# EAGLE design dronestand (EAGLE 9.3.2)
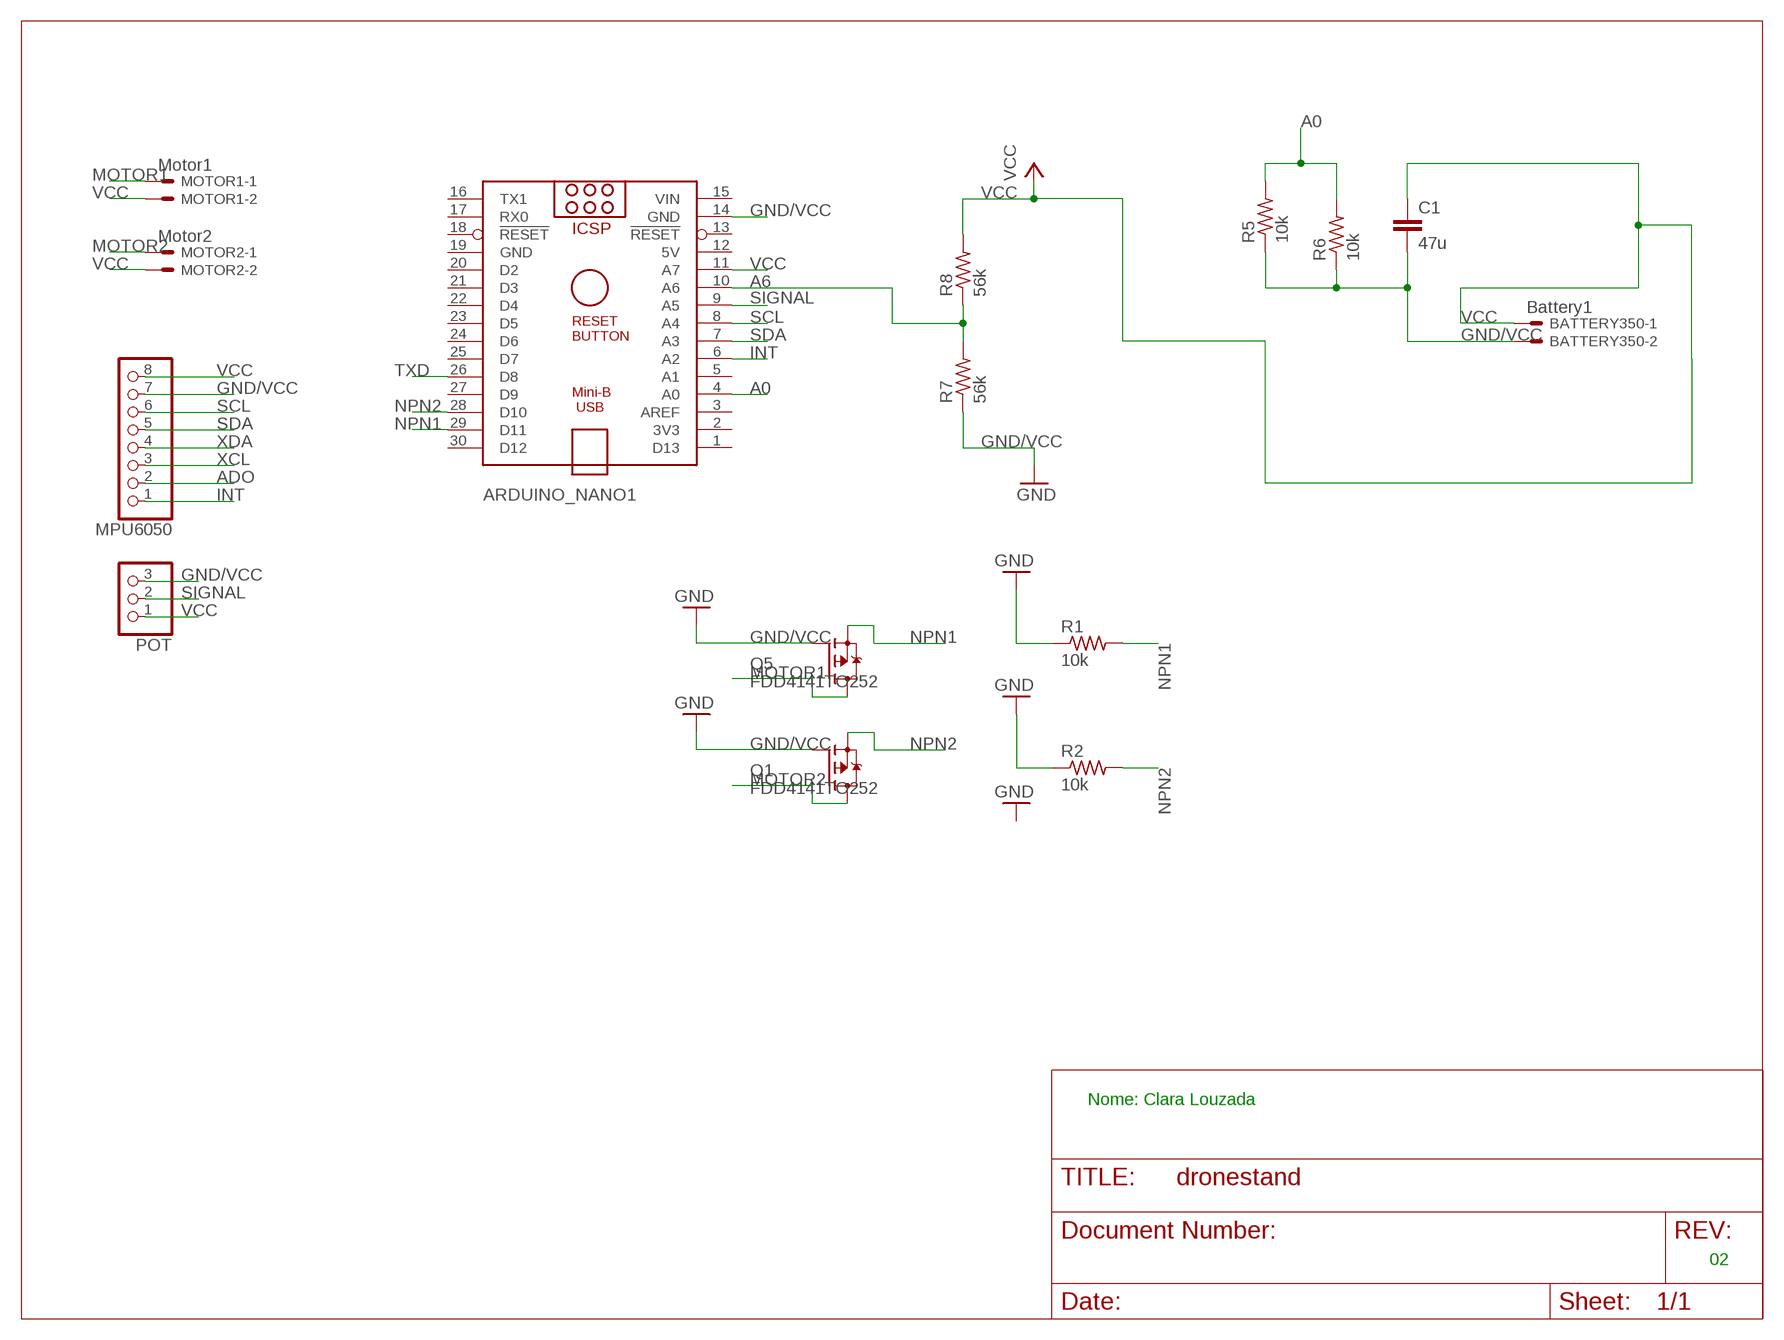
[diagram p0: schematic, sheet 1]

## Parts
ARDUINO_NANO1  ARDUINO_NANO  [ARDUINO_NANO]
BATTERY350  Battery1  JST-XH-02-PIN-LONG-PAD  [JST-XH-02-PACKAGE-LONG-PAD]
C1  47u  C2,5-3  [C2.5-3]
MOTOR1  Motor1  JST-XH-02-PIN-LONG-PAD  [JST-XH-02-PACKAGE-LONG-PAD]
MOTOR2  Motor2  JST-XH-02-PIN-LONG-PAD  [JST-XH-02-PACKAGE-LONG-PAD]
MPU6050  PINHD-1X8  [1X08]
POT  PINHD-1X3  [1X03]
Q1  FDD4141TO252  [TO252]
Q5  FDD4141TO252  [TO252]
R1  10k  R-US_0204/7  [0204/7]
R2  10k  R-US_0204/7  [0204/7]
R5  10k  R-US_0204/7  [0204/7]
R6  10k  R-US_0204/7  [0204/7]
R7  56k  R-US_0204/7  [0204/7]
R8  56k  R-US_0204/7  [0204/7]

## Nets
A0: ARDUINO_NANO1.4(A0) R5.2 R6.2
A6: ARDUINO_NANO1.10(A6) R7.2 R8.1
ADO: MPU6050.2
GND/VCC: ARDUINO_NANO1.14(GND) BATTERY350.2 C1.2 MPU6050.7 POT.3 Q1.1(G) Q5.1(G) R1.1 R2.1 R5.1 R6.1 R7.1 ; supply symbol labelled GND
INT: ARDUINO_NANO1.6(A2) MPU6050.1
MOTOR1: MOTOR1.1 Q5.3(D)
MOTOR2: MOTOR2.1 Q1.3(D)
NPN1: ARDUINO_NANO1.29(D11) Q5.2(S) R1.2
NPN2: ARDUINO_NANO1.28(D10) Q1.2(S) R2.2
SCL: ARDUINO_NANO1.8(A4) MPU6050.6
SDA: ARDUINO_NANO1.7(A3) MPU6050.5
SIGNAL: ARDUINO_NANO1.9(A5) POT.2
TXD: ARDUINO_NANO1.26(D8)
VCC: ARDUINO_NANO1.11(A7) BATTERY350.1 C1.1 MOTOR1.2 MOTOR2.2 MPU6050.8 POT.1 R8.2
XCL: MPU6050.3
XDA: MPU6050.4
Unconnected: ARDUINO_NANO1.1(D13) ARDUINO_NANO1.2(3V3) ARDUINO_NANO1.3(AREF) ARDUINO_NANO1.5(A1) ARDUINO_NANO1.13(!RESET) ARDUINO_NANO1.16(TX1) ARDUINO_NANO1.17(RX0) ARDUINO_NANO1.18(!RESET) ARDUINO_NANO1.20(D2) ARDUINO_NANO1.21(D3) ARDUINO_NANO1.22(D4) ARDUINO_NANO1.23(D5) ARDUINO_NANO1.24(D6) ARDUINO_NANO1.25(D7) ARDUINO_NANO1.27(D9) ARDUINO_NANO1.30(D12)

## Notes on the sheet
- Nome: Clara Louzada
- 02

## Power pins joined to a net without a drawn wire
5V: ARDUINO_NANO1.12(5V)
GND/VCC: ARDUINO_NANO1.19(GND)
VIN: ARDUINO_NANO1.15(VIN)

## Library data of the parts
ARDUINO_NANO1 = ArduinoNanoV30:ARDUINO_NANO: Arduino Nano V3.0 Overview: The Arduino Nano is a small, complete, and breadboard-friendly board based on the ATmega328 (Arduino Nano 3.x) or ATmega168 (Arduino Nano 2.x). It has more or less the same functionality of the Arduino Duemilanove, but in a different package. It lacks only a DC power jack, and works with a Mini-B USB cable instead of a standard one. The Nano was designed and is being produced by Gravitech. Specifications: Microcontroller Atmel ATmega168 or ATmega328 Operating Voltage (logic level) 5 V Input Voltage (recommended) 7-12 V Input Voltage (limits) 6-20 V Digital I/O Pins 14 (of which 6 provide PWM output) Analog Input Pins 8 DC Current per I/O Pin 40 mA Flash Memory 16 KB (ATmega168) or 32 KB (ATmega328) of which 2 KB used by bootloader SRAM 1 KB (ATmega168) or 2 KB (ATmega328) EEPROM 512 bytes (ATmega168) or 1 KB (ATmega328) Clock Speed 16 MHz Dimensions 0.73" x 1.70" Length 45 mm Width 18 mm Weigth 5 g Power: The Arduino Nano can be powered via the Mini-B USB connection, 6-20V unregulated external power supply (pin 30), or 5V regulated external power supply (pin 27). The power source is automatically selected to the highest voltage source. Memory: The ATmega168 has 16 KB of flash memory for storing code (of which 2 KB is used for the bootloader); the ATmega328 has 32 KB, (also with 2 KB used for the bootloader). The ATmega168 has 1 KB of SRAM and 512 bytes of EEPROM (which can be read and written with the EEPROM library); the ATmega328 has 2 KB of SRAM and 1 KB of EEPROM. Input and Output: Each of the 14 digital pins on the Nano can be used as an input or output, using pinMode(), digitalWrite(), and digitalRead() functions. They operate at 5 volts. Each pin can provide or receive a maximum of 40 mA and has an internal pull-up resistor (disconnected by default) of 20-50 kOhms. In addition, some pins have specialized functions. Visit Arduino - ArduinoBoardNano <https://www.arduino.cc/en/Main/ArduinoBoardNano>
BATTERY350 MOTOR1 MOTOR2 = Rembrandt Electronics - JST XH Connectors v1-0:JST-XH-02-PIN: JST XH Connector 2 Pin Wire to board connector. Pitch: 2,54 mm, (0.100") Number of pins: 2 Created by Rembrandt Electronics www.rembrandtelectronics.com
C1 = capacitor-wima:C: CAPACITOR naming: grid - package width
MPU6050 = pinhead:PINHD-1X8: PIN HEADER
POT = pinhead:PINHD-1X3: PIN HEADER
Q1 Q5 = transistor-fet:FDD4141: P-Channel PowerTrench® MOSFET Source: FDD4141.pdf
R1 R2 R5-R8 = resistor:R-US_: RESISTOR, American symbol

## Board
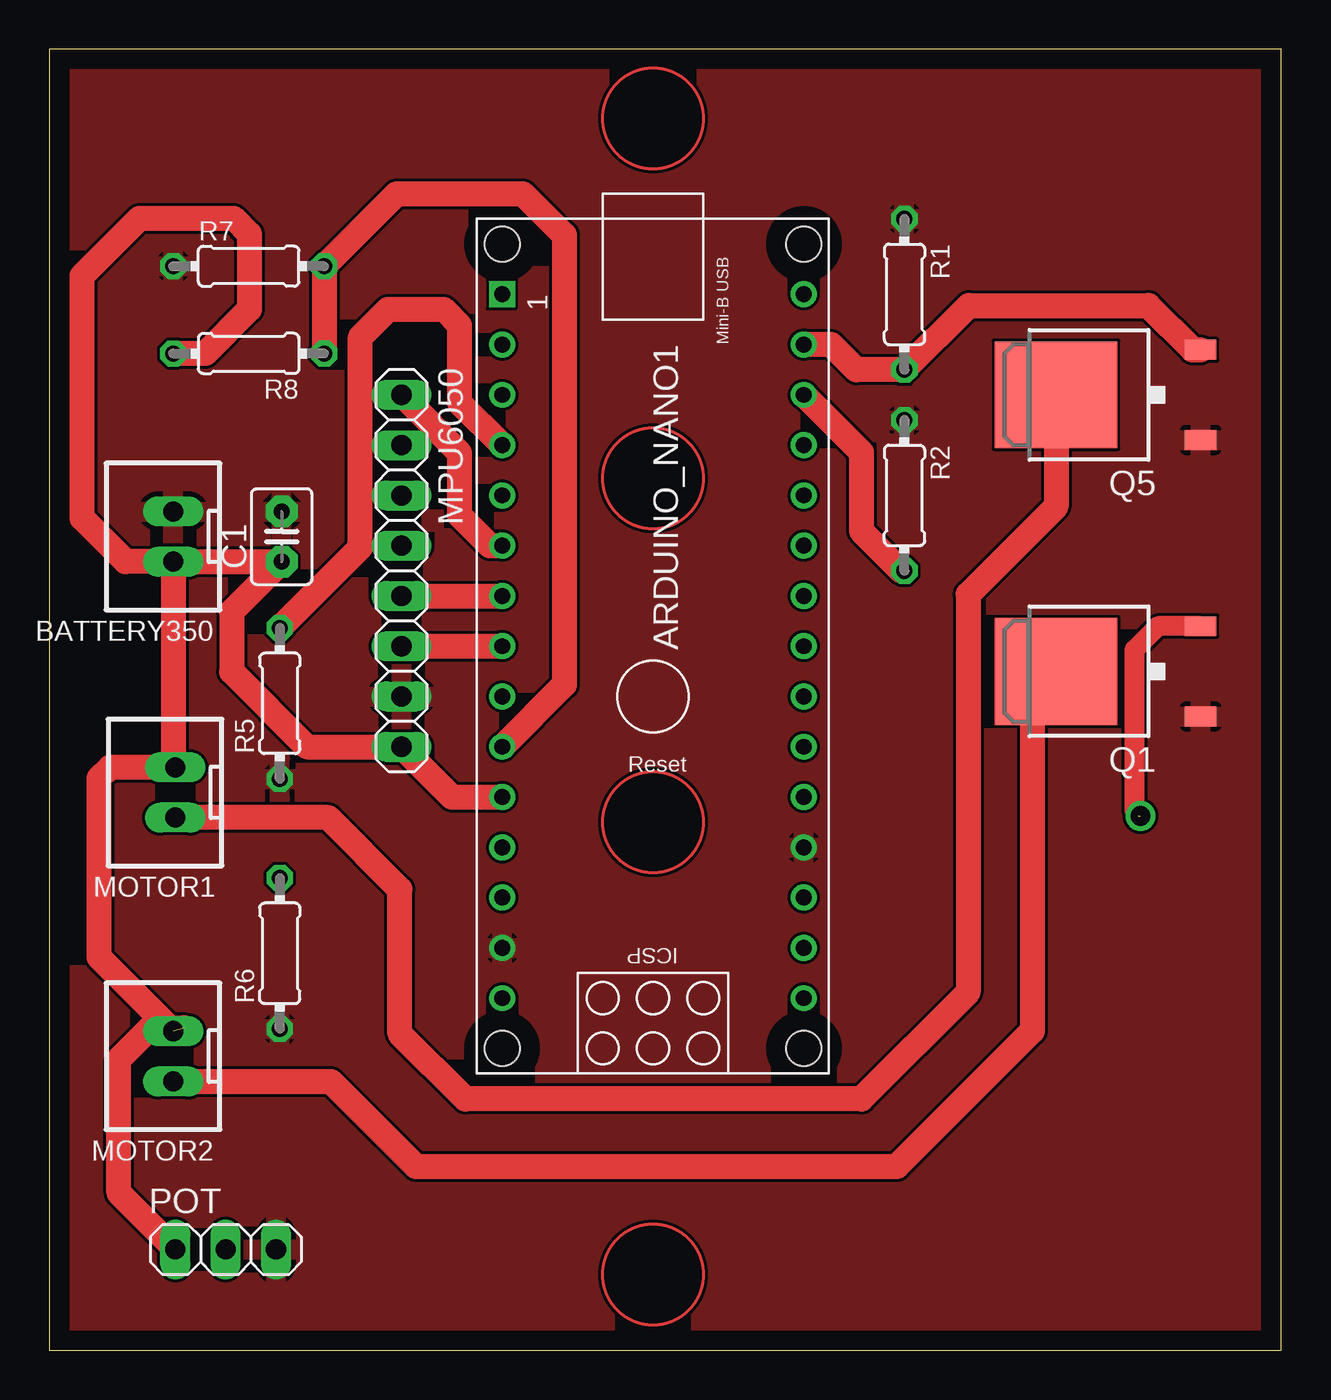
[diagram p1: board, top side]
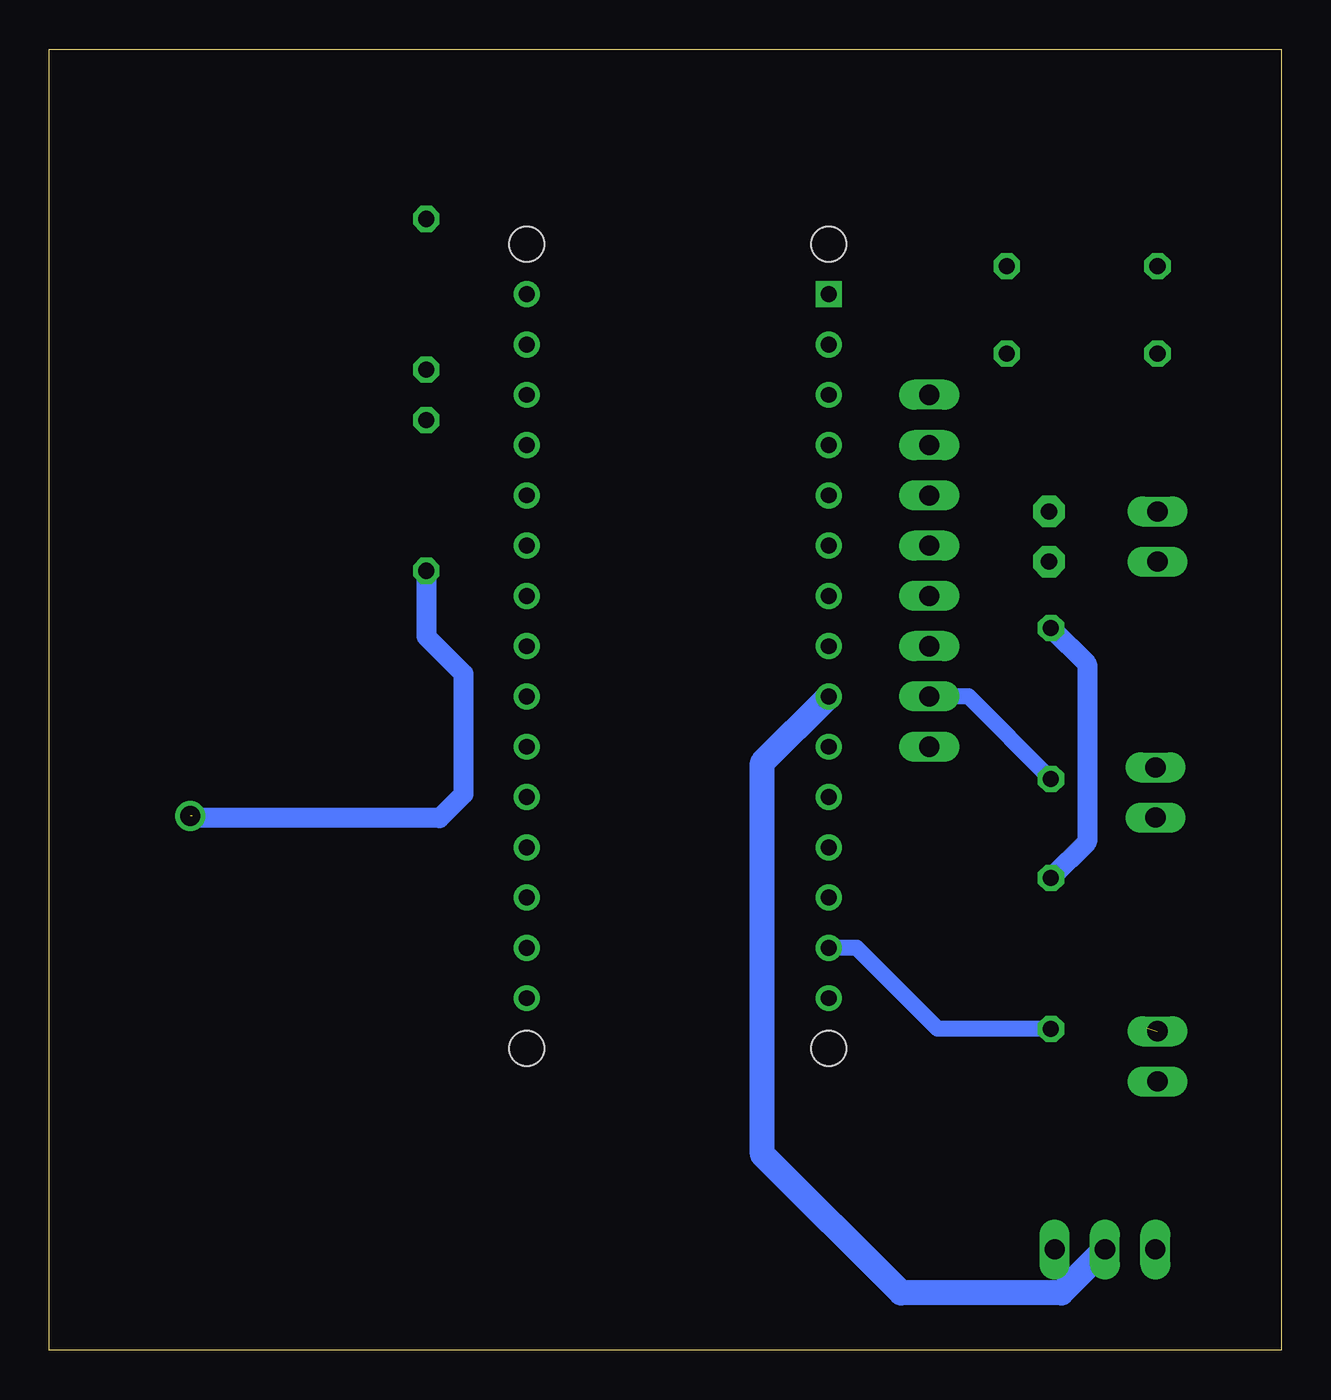
[diagram p2: board, bottom side, seen from below]

Size 62.21 x 65.71 mm. Coordinates in mm from the lower left corner, seen from the top.
Outline: 0,0 62.21,0 62.21,65.71 0,65.71 0,0
Copper layers (1*16): Top 0.035mm / dielectric 1.5mm / Bottom 0.035mm
Design rules "default": minimum track width 6mil, minimum drill 0.35mm, track to track 6mil, track to pad 6mil, pad to pad 6mil, via to via 6mil, smd to smd 6mil, copper to edge 40mil, drill to drill 6mil, minimum pad ring 10mil, minimum via ring 8mil, stop-mask expansion 4mil, vias tented up to drill 0mil, thermal gap 10mil

### Footprints (pad centres in the part's own frame; a part is rotated, then mirrored left to right if it is on the bottom)
ARDUINO_NANO = drill 0.8 square: 1 -20.32,-7.62 | drill 0.8: 2 -17.78,-7.62; 3 -15.24,-7.62; 4 -12.7,-7.62; 5 -10.16,-7.62; 6 -7.62,-7.62; 7 -5.08,-7.62; 8 -2.54,-7.62; 9 0,-7.62; 10 2.54,-7.62; 11 5.08,-7.62; 12 7.62,-7.62; 13 10.16,-7.62; 14 12.7,-7.62; 15 15.24,-7.62; 16 15.24,7.62; 17 12.7,7.62; 18 10.16,7.62; 19 7.62,7.62; 20 5.08,7.62; 21 2.54,7.62; 22 0,7.62; 23 -2.54,7.62; 24 -5.08,7.62; 25 -7.62,7.62; 26 -10.16,7.62; 27 -12.7,7.62; 28 -15.24,7.62; 29 -17.78,7.62; 30 -20.32,7.62 | hole 1.778: -22.86,-7.62; -22.86,7.62; 17.78,7.62; 17.78,-7.62
JST-XH-02-PACKAGE-LONG-PAD = drill 1.016 long: 1 -1.27,0; 2 1.27,0
C2.5-3 = drill 0.813 pad 1.6 octagon: 1 -1.27,0; 2 1.27,0
1X08 = drill 1.016 long: 1 -8.89,0; 2 -6.35,0; 3 -3.81,0; 4 -1.27,0; 5 1.27,0; 6 3.81,0; 7 6.35,0; 8 8.89,0
1X03 = drill 1.016 long: 1 -2.54,0; 2 0,0; 3 2.54,0
TO252 = smd 1 x 1.6: 1 -2.28,-4.8; 2 2.28,-4.8 | smd 5.4 x 6.2: 3 0,2.5
0204/7 = drill 0.813 octagon: 1 -3.81,0; 2 3.81,0

### Placement (x,y rotation side)
ARDUINO_NANO1  30.48,33.02 270 top
BATTERY350  6.25,41.1 90 top
C1  11.73,41.1 90 top
MOTOR1  6.35,28.17 90 top
MOTOR2  6.25,14.84 90 top
MPU6050  17.78,39.37 270 top
POT  8.9,5.08 0 top
Q1  53.34,34.29 90 top
Q5  53.34,48.26 90 top
R1  43.18,53.34 270 top
R2  43.18,43.18 270 top
R5  11.63,32.67 90 top
R6  11.63,20.04 90 top
R7  10.06,54.76 0 top
R8  10.06,50.35 180 top

### Tracks (layer width: path | path; a pad name or v marks a point on that pad's centre or on a via)
A0
  Top 1.27: R5.2 15.7,40.55 15.7,51.18 17.1,52.58 19.9,52.58 20.7,51.78 20.7,47.88 ARDUINO_NANO1.4
  Bottom 1.016: R5.2 9.8,34.65 9.8,25.68 R6.2
A6
  Top 1.27: R8.1 R7.2 17.53,58.42 23.91,58.42 26,56.33 26,33.62 ARDUINO_NANO1.10
GND/VCC
  Bottom 0.813: R6.1 17.35,16.23 21.44,20.32 ARDUINO_NANO1.14 | R5.1 15.79,33.02 MPU6050.7
  pour Top: 0.3,65.68 62,65.68 62.1,65.78 62.1,0.08 62.2,-0.02 0.2,-0.02 0.1,0.08 0.1,65.78
INT
  Top 1.27: MPU6050.1 20.7,45.34 20.7,42.18 22.24,40.64 ARDUINO_NANO1.6
MOTOR1
  Top 1.27: Q5.3 50.84,42.62 46.4,38.18 46.4,18.08 41,12.68 21,12.68 17.7,15.98 17.7,23.28 14.08,26.9 MOTOR1.1
MOTOR2
  Top 1.27: MOTOR2.1 14.21,13.57 18.5,9.28 42.8,9.28 49.64,16.12 49.64,33.09 Q1.3
N$1  (via drill 1)
  other vias: 55.1,26.98
NPN1
  Top 1.27: ARDUINO_NANO1.29 39.48,50.8 40.75,49.53 R1.2 46.43,52.78 55.5,52.78 57.74,50.54 Q5.2
NPN2  (1 unrouted)
  Top 1.016: Q1.2 55.99,36.57 54.8,35.38 54.8,27.28 55.1,26.98
  Top 1.27: ARDUINO_NANO1.28 41,45.36 41,41.38 43.01,39.37 R2.2
  Bottom 1.016: R2.2 43.18,36.06 41.3,34.18 41.3,28.08 42.5,26.88 54.9,26.88 55,26.98
SCL
  Top 1.27: MPU6050.6 ARDUINO_NANO1.8
SDA
  Top 1.27: MPU6050.5 ARDUINO_NANO1.7
SIGNAL
  Bottom 1.27: POT.2 11.1,2.88 19.2,2.88 26.2,9.88 26.2,29.68 ARDUINO_NANO1.9
VCC  (1 unrouted)
  Top 1.27: BATTERY350.1 C1.1 9.2,37.3 9.2,34.28 13,30.48 MPU6050.8 20.32,27.94 ARDUINO_NANO1.11 | BATTERY350.1 6.25,29.54 MOTOR1.2 3.06,29.44 2.5,28.88 2.5,19.86 MOTOR2.2 | BATTERY350.1 3.85,39.83 1.65,42.03 1.65,54.28 4.55,57.18 9.3,57.18 10.1,56.38 10.1,52.58 7.87,50.35 R8.2 | POT.1 3.5,7.94 3.5,14.68 5.1,16.28 6.8,16.28
(copper drawn outside any net)
  shapes: Top circle x4